# Altium schematic sheet Sheet1.SchDoc
size A4
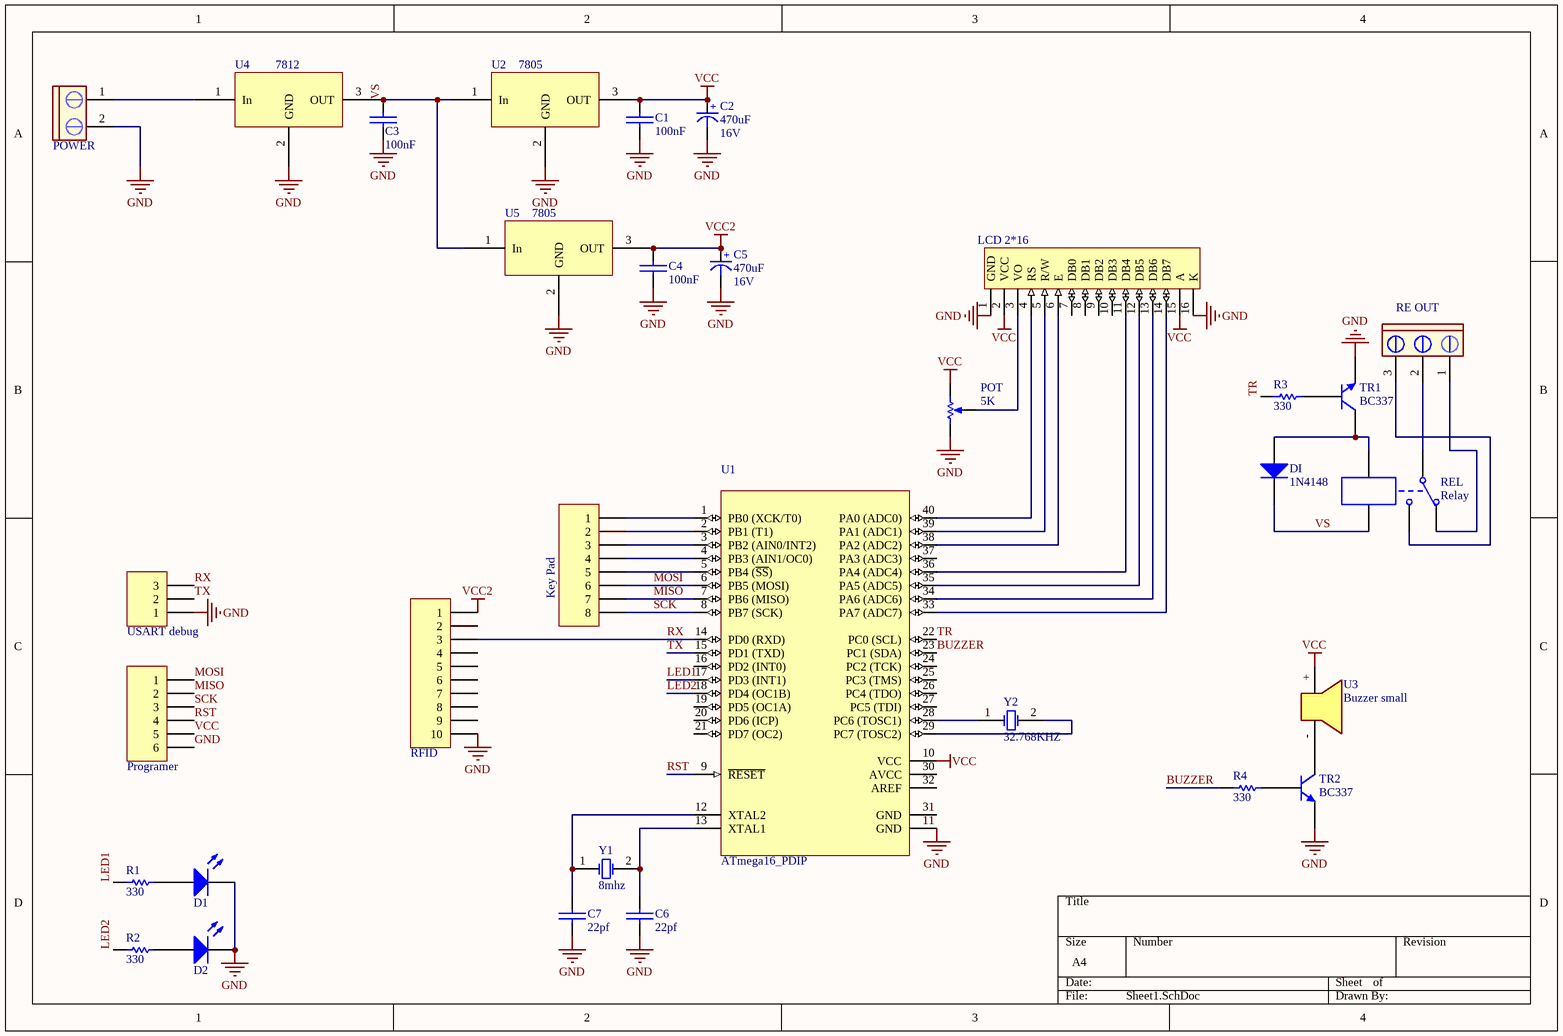
[diagram p0: Sheet1.SchDoc]

## Parts
C1  100nF  [Cap - 100nF]
C2  Voltage: 16V  [cap 04]  (hidden comment: 470uF)
C3  100nF  [Cap - 100nF]
C4  100nF  [Cap - 100nF]
C5  Voltage: 16V  [cap 04]  (hidden comment: 470uF)
C6  22pf  [Cap - 100nF]
C7  22pf  [Cap - 100nF]
D1  LED 5mm  [LED-1]  (value not drawn)
D2  LED 5mm  [LED-1]  (value not drawn)
DI  1N4148  [DO-35]
Key_Pad  Pin Header  [SIP8]  (value not drawn)
LCD_2*16  LCD 16X2  [My_LCD 16x2-A]  (value not drawn)
POT  5K  [POT-4]
POWER  CON2 pin blue  [My_CN2]  (value not drawn)
Programer  Pin Header  [SIP6]  (value not drawn)
R1  330  [AXIAL-0.3]
R2  330  [AXIAL-0.3]
R3  330  [AXIAL-0.3]
R4  330  [AXIAL-0.3]
RE_OUT  CON3 pin Green  [My_CN3]  (value not drawn)
REL  Relay  [RELAY-1]
RFID  Pin Header  [SIP10]  (value not drawn)
TR1  BC337  [TO-92-1]
TR2  BC337  [TO-92-1]
U1  ATmega16_PDIP  [DIP40]
U2  7805  [TO-220]
U3  Buzzer small  [My_Buzzer]
U4  7812  [TO-220]
U5  7805  [TO-220]
USART_debug  Pin Header  [SIP3]  (value not drawn)
Y1  8mhz  [XTAL]
Y2  32.768KHZ  [R38]

## Nets
GND: C1.2(-) C2.2(-) C3.2(-) C4.2(-) C5.2(-) C6.2(-) C7.2(-) D1.2(K) D2.2(K) LCD_2*16.1(GND) LCD_2*16.16(K) POT.1(TOP) POWER.2 Programer.6 RFID.10 TR1.3(E) TR2.3(E) U1.11(GND) U2.2(GND) U4.2(GND) U5.2(GND) USART_debug.1
VCC: C1.1(+) C2.1(+) LCD_2*16.2(VCC) LCD_2*16.15(A) POT.3(BOT) Programer.5 U1.10(VCC) U2.3(OUT) U3.+
VCC2: C4.1(+) C5.1(+) RFID.1 U5.3(OUT)
BUZZER: R4.1 U1.23(PC1_(SDA))
LED1: R1.1 U1.17(PD3_(INT1))
LED2: R2.1 U1.18(PD4_(OC1B))
MISO: Key_Pad.7 Programer.2 U1.7(PB6_(MISO))
MOSI: Key_Pad.6 Programer.1 U1.6(PB5_(MOSI))
RST: Programer.4 U1.9(~{RESET})
RX: RFID.3 U1.14(PD0_(RXD)) USART_debug.3
SCK: Key_Pad.8 Programer.3 U1.8(PB7_(SCK))
TR: R3.1 U1.22(PC0_(SCL))
TX: U1.15(PD1_(TXD)) USART_debug.2
VS: C3.1(+) DI.2(K) REL.5 U2.1(In) U4.3(OUT) U5.1(In)
NetC6_1: C6.1(+) U1.13(XTAL1) Y1.2(OSC2)
NetC7_1: C7.1(+) U1.12(XTAL2) Y1.1(OSC1)
NetD1_1: D1.1(A) R1.2
NetD2_1: D2.1(A) R2.2
NetDI_1: DI.1(A) REL.4 TR1.1(C)
NetKey_Pad_1: Key_Pad.1 U1.1(PB0_(XCK/T0))
NetKey_Pad_2: Key_Pad.2 U1.2(PB1_(T1))
NetKey_Pad_3: Key_Pad.3 U1.3(PB2_(AIN0/INT2))
NetKey_Pad_4: Key_Pad.4 U1.4(PB3_(AIN1/OC0))
NetKey_Pad_5: Key_Pad.5 U1.5(PB4_(~{SS}))
NetLCD_2*16_3: LCD_2*16.3(VO) POT.2(TAP)
NetLCD_2*16_4: LCD_2*16.4(RS) U1.40(PA0_(ADC0))
NetLCD_2*16_5: LCD_2*16.5(R/W) U1.39(PA1_(ADC1))
NetLCD_2*16_6: LCD_2*16.6(E) U1.38(PA2_(ADC2))
NetLCD_2*16_11: LCD_2*16.11(DB4) U1.36(PA4_(ADC4))
NetLCD_2*16_12: LCD_2*16.12(DB5) U1.35(PA5_(ADC5))
NetLCD_2*16_13: LCD_2*16.13(DB6) U1.34(PA6_(ADC6))
NetLCD_2*16_14: LCD_2*16.14(DB7) U1.33(PA7_(ADC7))
NetPOWER_1: POWER.1 U4.1(In)
NetR3_2: R3.2 TR1.2(B)
NetR4_2: R4.2 TR2.2(B)
NetRE_OUT_1: RE_OUT.1 REL.2
NetRE_OUT_2: RE_OUT.2 REL.1
NetRE_OUT_3: RE_OUT.3 REL.3
NetTR2_1: TR2.1(C) U3.-
NetU1_28: U1.28(PC6_(TOSC1)) Y2.1(OSC1)
NetU1_29: U1.29(PC7_(TOSC2)) Y2.2(OSC2)

Not connected (* = marked no-connect by the designer): LCD_2*16 7(DB0) 8(DB1) 9(DB2) 10(DB3); RFID 2 4 5 6 7 8 9; U1 16(PD2_(INT0)) 19(PD5_(OC1A)) 20(PD6_(ICP)) 21(PD7_(OC2)) 24(PC2_(TCK)) 25(PC3_(TMS)) 26(PC4_(TDO)) 27(PC5_(TDI)) 30(AVCC) 31(GND) 32(AREF) 37(PA3_(ADC3))

## Library data of the parts
C1 C3 C4 C6 C7 = Cap-Bipolar: Bipolar Capacitor; Voltage: 100V; Designer: Saeid Jorablo; Organazation: ControTec; Adding Date: 1387/12/20
  C1 C3 C4: Value: 100nF
  C6 C7: Value: 22pf
C2 C5 = Cap-Polar: Polar Capacitor; Designer: Saeid Jorablo; Organazation: ControTec; Adding Date: 1387/12/20; Value: 470uF
D1 D2 = LED 5mm: Typical LED; Designer: Seyed Mohsen Ghasemian; Published: 07/31/2012; PackageReference: LED; Publisher: www.picpars.com; PackageDescription: LED; 2 Leads
DI = Diode 1N4148: High Conductance Fast Diode; Published: 8-Jun-2000; LatestRevisionDate: 17-Jul-2002; LatestRevisionNote: Re-released for DXP Platform.; DatasheetVersion: 1997; PackageReference: DO-35; Publisher: Altium Limited; PackageDescription: Diode, Axial; Body 3.8 x 1.9 mm (LxDia. max), Lead Dia. 0.53 mm (max); Code_JEDEC: DO-204-AH; ComponentLink1Description: Manufacturer Link; ComponentLink1URL: http://www.fairchildsemi.com/; ComponentLink2Description: Datasheet; ComponentLink2URL: http://www.fairchildsemi.com/ds/1N%2F1N4148.pdf
Key_Pad = CON8
LCD_2*16 = LCD 16X2: LCD 16X2 Character lcd
POT = POT: Resistor; Value: 5K
POWER = CON2 pin blue: Connector blue screw
Programer = CON6
R1-R4 = Res: Resistor; Value: 330
RE_OUT = CON3 pin Green: Connector green screw
REL = Relay_1: Value: ?
RFID = CON10
TR1 TR2 = BC337: NPN Transistor
U1 = ATmega16_PDIP: 8-Bit AVR Microcontroller
U2 U4 U5 = 7805: Reglator
U3 = Buzzer: 5-12v small buzzer (12mm)
USART_debug = CON3
Y1 = XTAL: XTAL Crystal; Company: E.P.I.L; Design Date: 11/04/2011; Value: 8mhz
Y2 = XTAL: Crystal Oscillator; Published: 8-Jun-2000; LatestRevisionDate: 17-Jul-2002; LatestRevisionNote: Re-released for DXP Platform.; PackageReference: R38; Publisher: Altium Limited; PackageDescription: Crystal, Thru-Hole; 2 Leads; Body 3.1 x 8.2 mm (Dia.xH); VALUE: 32.768KHZ